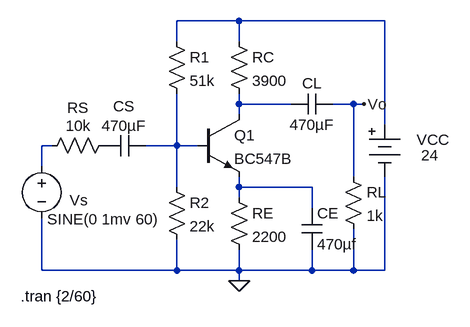
[diagram p0: schematic MODELO HIBRIDO - EMISOR COMUN - AEA.asc]
MODELO HIBRIDO - EMISOR COMUN - AEA.asc, the LTspice schematic file:
Version 4
SHEET 1 880 680
WIRE 272 -48 176 -48
WIRE 496 -48 272 -48
WIRE 176 -16 176 -48
WIRE 272 -16 272 -48
WIRE 272 80 272 64
WIRE 352 80 272 80
WIRE 448 80 416 80
WIRE 464 80 448 80
WIRE 272 96 272 80
WIRE 496 112 496 -48
WIRE -16 144 -32 144
WIRE 176 144 176 64
WIRE 176 144 128 144
WIRE 208 144 176 144
WIRE -32 176 -32 144
WIRE 448 192 448 80
WIRE 176 208 176 144
WIRE 272 208 272 192
WIRE 384 208 272 208
WIRE 272 224 272 208
WIRE 384 240 384 208
WIRE -32 336 -32 256
WIRE 176 336 176 288
WIRE 176 336 -32 336
WIRE 272 336 272 304
WIRE 272 336 176 336
WIRE 384 336 384 304
WIRE 384 336 272 336
WIRE 448 336 448 272
WIRE 448 336 384 336
WIRE 496 336 496 192
WIRE 496 336 448 336
WIRE 272 352 272 336
FLAG 272 352 0
FLAG 464 80 Vo
SYMBOL voltage -32 160 R0
WINDOW 0 43 68 Left 2
WINDOW 3 9 97 Left 2
WINDOW 123 0 0 Left 0
WINDOW 39 0 0 Left 0
SYMATTR InstName Vs
SYMATTR Value SINE(0 1mv 60)
SYMBOL npn 208 96 R0
SYMATTR InstName Q1
SYMATTR Value BC547B
SYMBOL res 256 -32 R0
SYMATTR InstName RC
SYMATTR Value 3900
SYMBOL res 256 208 R0
SYMATTR InstName RE
SYMATTR Value 2200
SYMBOL Misc\\battery 496 96 R0
WINDOW 0 49 39 Left 2
WINDOW 3 56 63 Left 2
SYMATTR InstName VCC
SYMATTR Value 24
SYMBOL cap 368 240 R0
SYMATTR InstName CE
SYMATTR Value 470µf
SYMBOL res 432 176 R0
SYMATTR InstName RL
SYMATTR Value 1k
SYMBOL cap 416 64 R90
WINDOW 0 0 32 VBottom 2
WINDOW 3 32 32 VTop 2
SYMATTR InstName CL
SYMATTR Value 470µF
SYMBOL res 80 128 R90
WINDOW 0 -27 56 VBottom 2
WINDOW 3 -30 55 VTop 2
SYMATTR InstName RS
SYMATTR Value 10k
SYMBOL cap 128 128 R90
WINDOW 0 -29 33 VBottom 2
WINDOW 3 -30 33 VTop 2
SYMATTR InstName CS
SYMATTR Value 470µF
SYMBOL res 160 -32 R0
SYMATTR InstName R1
SYMATTR Value 51k
SYMBOL res 160 192 R0
SYMATTR InstName R2
SYMATTR Value 22k
TEXT -64 376 Left 2 !.tran {2/60}

The netlist it stands for:
* MODELO HIBRIDO - EMISOR COMUN - AEA.asc
Vs N003 0 SINE(0 1mv 60)
Q1 N002 N004 N005 0 BC547B
RC N001 N002 3900
RE N005 0 2200
VCC N001 0 24
CE N005 0 470µf
RL Vo 0 1k
CL Vo N002 470µF
RS P001 N003 10k
CS N004 P001 470µF
R1 N001 N004 51k
R2 N004 0 22k
.model NPN NPN
.model PNP PNP
.lib standard.bjt
.tran {2/60}
.backanno
.end